# Altium schematic sheet startStop.SchDoc
size A4
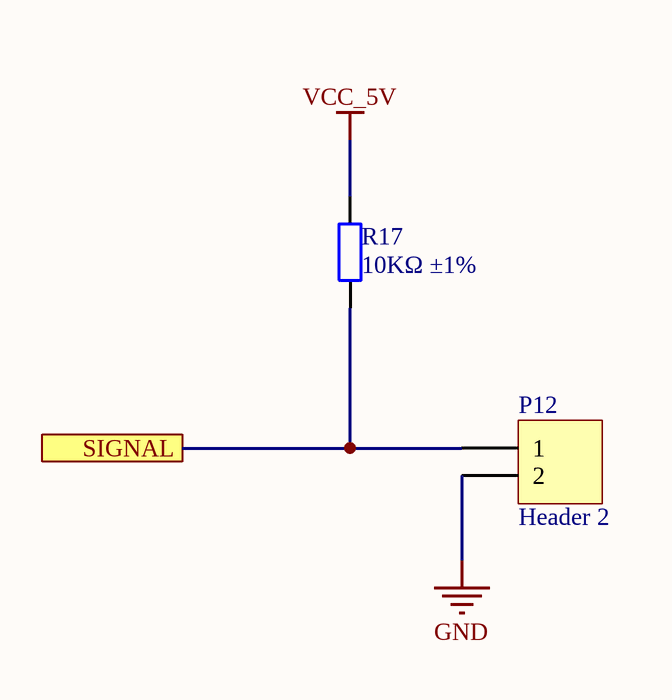
[diagram p0: startStop.SchDoc]

## Parts
P12  Header 2  [HDR1X2]
R17  10KΩ ±1%  [0603_R]

## Ports
SIGNAL

## Nets
GND: P12.2
VCC_5V: R17.2
SIGNAL: P12.1 R17.1 ; port SIGNAL

## Library data of the parts
P12 = Header 2: Header, 2-Pin; LatestRevisionDate: 17-Jul-2002; LatestRevisionNote: Re-released for DXP Platform.; Publisher: Altium Limited
R17 = 0603 10K (1002) 1%: Chip resistor; Manufacturer: Uniroyal Elec; PartNumber: 0603WAF1002T5E; Power: 1/10W; ComponentLink1Description: Supplier link; ComponentLink1URL: http://www.szlcsc.com/product/details_26547.html; Package: 0603; Supplier: LC; SuppliersPartNumber: C25804; Resistance: 10KΩ; Tolerance: 1%